# Altium project Pin radiation counter Main board.PrjPcb
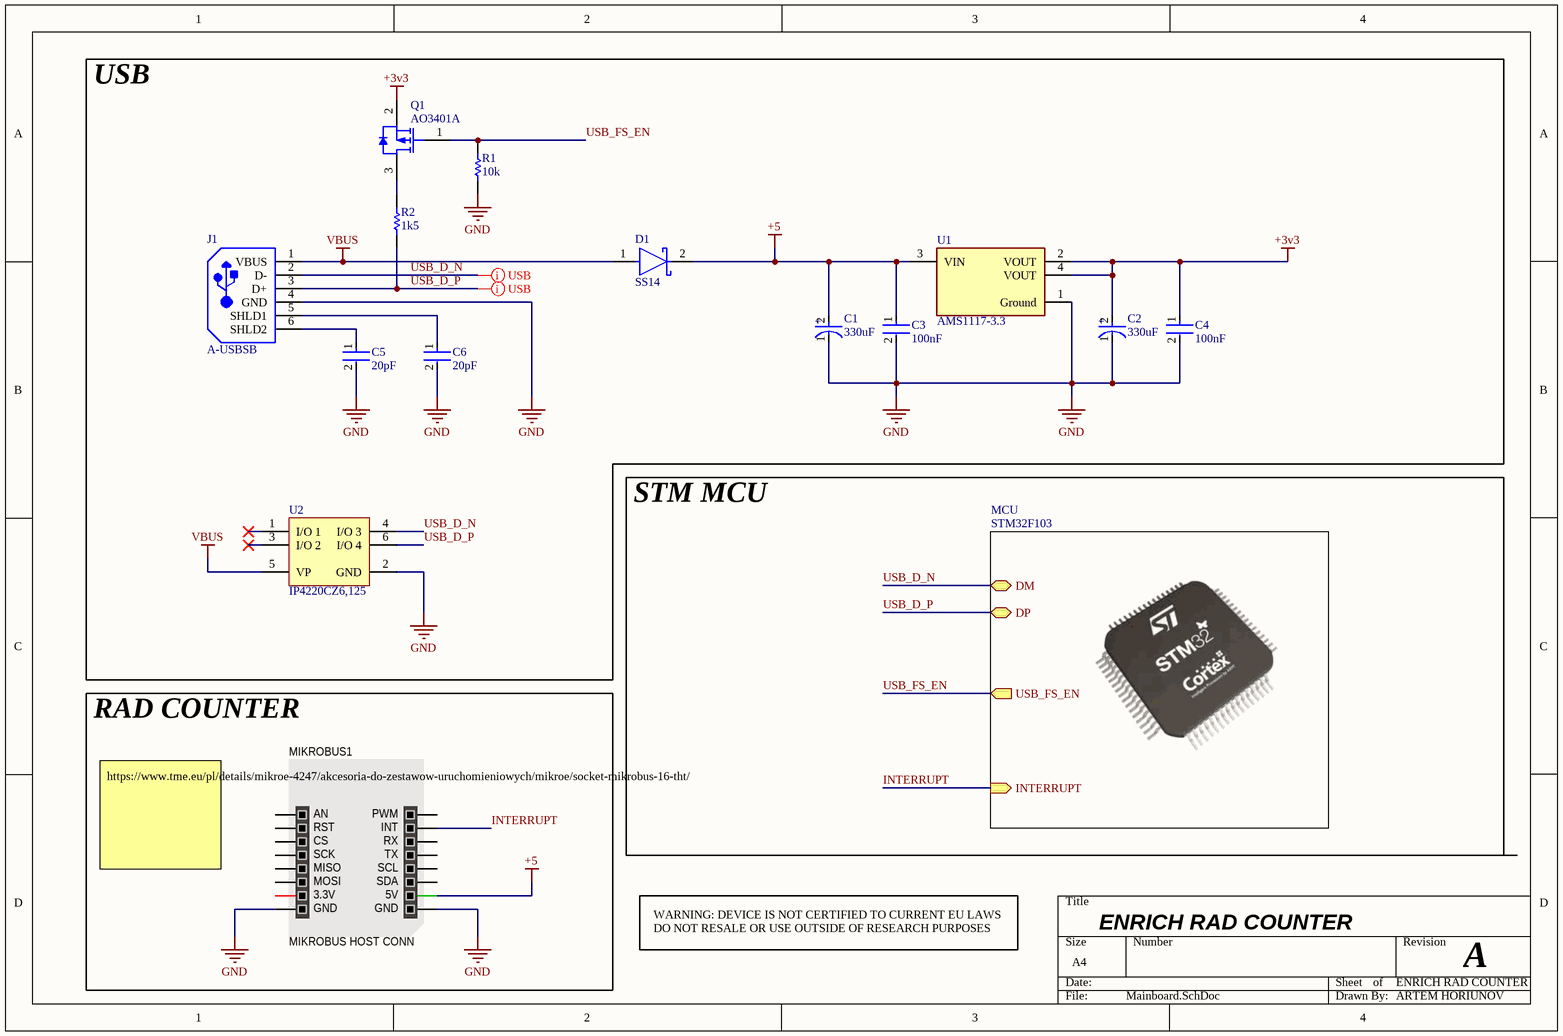
[diagram p0: Mainboard.SchDoc]
2 sheets, 51 parts. Net scope: hierarchical (ports join the sheet entries above them; power ports are global).
Board file: Mainboard.PcbDoc
Sheets:
  Mainboard.SchDoc
    MCU = STM32F103.SchDoc

## Sheet Mainboard.SchDoc
size A4; SheetNumber: 1; SheetTotal: 2

### Parts
C1  330uF  [FP-OS-CON-SMT-F12-MFG]
C2  330uF  [FP-OS-CON-SMT-F12-MFG]
C3  100nF  [FP-C0402-BB-MFG]
C4  100nF  [FP-C0402-BB-MFG]
C5  20pF  [FP-C0603C-CF-MFG]
C6  20pF  [FP-C0603C-CF-MFG]
D1  SS14  [FP-403AE-MFG]
J1  A-USBSB  [ASSM-A-USBSB-4_V]
MIKROBUS1  MIKROBUS HOST CONN  [MIKROBUS HOST CONN 8gen TH]
Q1  AO3401A  [AO-SOT-23-3L_V]
R1  10k  [RESC1609X50X30NL8T20]
R2  1k5  [RESC1608X55X30ML15T15]
U1  AMS1117-3.3  [FP-AMS1117-IPC_C]
U2  IP4220CZ6,125  [NXP-SOT457_L]

### Blocks framed on the sheet
USB: C1-C6 D1 J1 Q1 R1 R2 U1 U2
RAD COUNTER: MIKROBUS1

### Sub-sheets
MCU = STM32F103: DM (bidir), DP (bidir), INTERRUPT (in), USB_FS_EN (out)

### Nets
+3v3: C2.2(A) C4.1 Q1.2(SOURCE) U1.2(VOUT) U1.4(VOUT)
+5: C1.2(A) C3.1 D1.2(C) MIKROBUS1.10(5V) U1.3(VIN)
GND: C1.1(C) C2.1(C) C3.2 C4.2 C5.2 C6.2 J1.4(GND) MIKROBUS1.8(GND) MIKROBUS1.9(GND) R1.2 U1.1(Ground) U2.2(GND)
VBUS: D1.1(A) J1.1(VBUS) U2.5(VP)
INTERRUPT: MIKROBUS1.15(INT) ; sheet MCU/INTERRUPT
USB_D_N: J1.2(D-) U2.4(I/O_3) ; sheet MCU/DM
USB_D_P: J1.3(D+) R2.1 U2.6(I/O_4) ; sheet MCU/DP
USB_FS_EN: Q1.1(GATE) R1.1 ; sheet MCU/USB_FS_EN  [project net USB FS EN]
NetC5_1: C5.1 J1.6(SHLD2)
NetC6_1: C6.1 J1.5(SHLD1)
NetQ1_3: Q1.3(DRAIN) R2.2

Not connected (* = marked no-connect by the designer): MIKROBUS1 1(AN) 2(RST) 3(CS) 4(SCK) 5(MISO) 6(MOSI) 7(3.3V) 11(SDA) 12(SCL) 13(TX) 14(RX) 16(PWM); U2 1(I/O_1)* 3(I/O_2)*

### Layout directives
differential pair: USB_D_N, USB_D_P

### Notes on the sheet
- STM MCU
- https://www.tme.eu/pl/details/mikroe-4247/akcesoria-do-zestawow-uruchomieniowych/mikroe/socket-mikrobus-16-tht/
- WARNING: DEVICE IS NOT CERTIFIED TO CURRENT EU LAWS
- DO NOT RESALE OR USE OUTSIDE OF RESEARCH PURPOSES
- ENRICH RAD COUNTER
- A
- ARTEM HORIUNOV
- (in symbol CMP-2000-05494-3) +

### Library data of the parts
C1 C2 = CMP-2000-05494-3: Conductive Polymer Aluminum Solid Capacitors (OS-CON) 330uF ±20% 16V RADIAL SMT 10x12.6mm; Ripple Current: 4.72A; ESR (Equivalent Series Resistance): 16mR; Polarity: Polar; Dissipation Factor: 15%; Leakage Current: 792uA; Life (Hours): 2000Hour; REACH SVHC: No SVHC; Radiation Hardening: No; Termination: SMD/SMT; Height: 12.6mm; Package Quantity: 400; Capacitance: 330uF; Number of Pins: 12; Height - Seated (Max): 0.5inch; RoHS Compliant: Yes; Tolerance: 20%; Material: Polymer; Packaging: Tape and Reel; Mount: Surface Mount; Lead Free: Lead Free; Voltage Rating: 16V; Diameter: 10mm; Max Operating Temperature: 105°C; Voltage Rating (DC): 16V; Voltage: 16V; Ripple Current (AC): 4.72A; Construction: Cylindrical; Length: 12.6mm; Case/Package: Radial; Min Operating Temperature: -55°C; Series: OS-CON™, SVP
C3 C4 = CMP-2008-02046-2: CAP CER 0.1UF 10V X5R 0402; Manufacturer: Kemet; Manufacturer Part Number: C0402C104K8PACTU; Material: Ceramic; Capacitance: 0.10 μF; Temperature Coefficient: 15%; Tolerance: 0.1; Value: 0.10 μF; Package: C0402-BB; Temperature: -55°C to +125°C; ComponentLink2Description: Datasheet; Temperature Characteristic: X5R; Device Class L1: Passive Components; Height: 0.55mm; Lead Free: Yes; ComponentLink2URL: https://content.kemet.com/datasheets/KEM_C1002_X7R_SMD.pdf; Device Class L2: Capacitors; Temperature Range Low: -55°C; Temperature Range High: +125°C; RoHS: TRUE; Octopart: https://octopart.com/c0402c104k8pactu-kemet-140039; Automotive: No; Mouser Description: Capacitor 100 nF 10 VDC 0402; Category: Cap; Voltage Rating: 10 V; Digikey Description: CAP CER 0.1UF 10V X5R 0402; Ipc Land Pattern Name: CAPC10050X50; Device Class L3: Ceramic Capacitors
C5 C6 = CMP-1035-00783-3: CAP CER 20PF 50V 5% NP0 0603; Manufacturer Part Number: C0603C200J5GACTU; Manufacturer: KEMET; Temperature Coefficient: 30ppm/°C; Temperature Characteristic: C0G; Automotive Grade: Grade 1; Tolerance: 0.05; Material: Ceramic; Category: Cap; Temperature Range Low: -55°C; RoHS: TRUE; ComponentLink2URL: https://api.kemet.com/component-edge/download/datasheet/C0603C100J5GACAUTO.pdf; Package: C0603C-CF; Height: 0.87mm; Capacitance: 20 pF; Voltage Rating: 50 V; Octopart: https://octopart.com/c0603c200j5gactu-kemet-9138585; Device Class L1: Passive Components; Automotive: Yes; Digikey Description: CAP CER 20PF 50V 5% NP0 0603; Temperature Range High: +125°C; Device Class L3: Ceramic Capacitors; Mouser Description: Multilayer Ceramic Capacitors MLCC - SMD/SMT 50volts 20pF C0G 5%; ComponentLink2Description: Datasheet; Device Class L2: Capacitors; Lead Free: Yes; Temperature: -55°C to +125°C; Value: 20 pF
D1 = CMP-2000-04943-2: DIODE SCHOTTKY 40V 1A SMA; Manufacturer: ON Semiconductor; Peak Reverse Current: 0.2mA; Max Junction Temp: +125°C; Standoff Height: 0.05mm; Max Surge Forward Current: 40A; Mouser Description: Schottky Diodes & Rectifiers SMA 40V 1.0A; RoHS: TRUE; Lead Free: Yes; Manufacturer Part Number: SS14; Device Class L3: Schottky Diodes; Category: Diode; Automotive: No; Digikey Description: DIODE SCHOTTKY 40V 1A SMA; ComponentLink2Description: Datasheet; Device Class L2: Diodes; Height: 2.5mm; Temperature Range High: +125°C; ComponentLink2URL: https://www.onsemi.com/pub/Collateral/SS19-D.PDF; Device Class L1: Discrete Semiconductors; Package: 403AE; Octopart: https://octopart.com/ss14-on+semiconductor-29205033; Max Repetitive Reverse Voltage: 40V; Temperature Range Low: -65°C; Forward Current: 1A; Temperature: -65°C to +125°C
J1 = CMP-2000-05874-1: Connector Receptacle, USB Type B, Right Angle, -20 to 85 degC, 4-Pin THD, RoHS, Tray; Manufacturer: ASSMANN WSW; Gender: Female; CAD Drawing: 3DCADModel; Number of Ports: 1; Mounting Type: ThroughHole; Datasheet URL: https://datasheet.ciiva.com/11731/0900766b80da421f-11731321.pdf; Datasheet Version: 12/2009; Manufacturer URL: http://www.assmann.us/; Package Description: 4-Pin Through Hole Device, Body 16.5 x 12.04 mm; Body Orientation: RightAngle; Mounting Technology: ThroughHole; Package Reference: USBSB; Termination Method: Solder
Q1 = CMP-2000-05778-1: P-Channel MOSFET, 30 V, 4 A, -55 to 150 degC, 3-Pin SOT-23-3L, RoHS, Tape and Reel; Manufacturer: Alpha and Omega; Output Power (Max): NotRequiredW; Power Dissipation: 1.4W; Rad Hardened: No; Drain Efficiency: NotRequired%; Drain-Source On-Volt: 30V; Noise Figure: NotRequireddB; Frequency (Max): NotRequiredMHz; Number of  Elements: 1; Gate-Source Voltage (Max): ?12V; Drain Current (Max): 4A; Channel Mode: Enhancement; Drain-Source On-Res: 0.044ohm; Type: PowerMOSFET; Polarity: P; Package URL: http://www.aosmd.com/res/packaging_information/SOT-23-3L.pdf; Datasheet URL: http://www.aosmd.com/res/data_sheets/AO3401A.pdf; Package Type: SOT-23; Package Description: 3-Pin Small Outline Transistor, Body 2.95 x 1.6 mm, Pitch 0.95 mm; Mounting: SurfaceMount; Manufacturer URL: http://www.aosmd.com/; Continuous Drain Current: 4A; Package Reference: SOT-23-3L; Mounting Technology: SurfaceMount; Operating Temperature Classification: Military; Power Gain: NotRequireddB; Datasheet Version: Rev. 3, 03/2011; Operating Temp Range: -55Cto150C; Pin Count: 3
R1 = CMP-1666-00005-4: Chip Resistor, 10 KOhm, +/- 1%, 100 mW, -55 to 155 degC, 0603 (1608 Metric), RoHS, Tape and Reel; Manufacturer: Vishay Semiconductor; Voltage Rating: 75 V; Max Operating Temperature: 155 degC; PackageDescription: 2-Pin Surface Mount Device, Body 1.575 x 0.85 mm; ComponentLink1Description: Manufacturer URL; RoHSCompliant: true; PackageReference: 0603; REACH SVHC: Unknown; Length: 1.55 mm; DatasheetVersion: 06/2012; Packaging: Tape and Reel; Min Operating Temperature: -55 degC; Mounting Technology: Surface Mount; ComponentLink2URL: https://datasheet.ciiva.com/11809/0900766b80d98afc-11809037.pdf; Height: 0.45 mm; ComponentLink2Description: Datasheet; Package Quantity: 5000; ComponentLink1URL: http://www.vishay.com/
R2 = CMP-1012-00528-2: Part Number: ERJ-3EKF1501V; Manufacturer: Panasonic
U1 = CMP-209535-000001-1: LDO Voltage Regulators 1A, 3.3V; Manufacturer: Advanced Monolithic Systems; Dropout Voltage: 1.1V; Output Type: Fixed; Nominal Supply Current: 5mA; Max Power Dissipation: 1.2W; Max Supply Voltage: 15V; Number Of Outputs: 1; Standoff Height: 0.64mm; Max Junction Temp: +125°C; Height: 1.8mm; Package: AMS1117; Device Class L2: Power Management ICs; ComponentLink2Description: Datasheet; ComponentLink2URL: http://www.advanced-monolithic.com/pdf/ds1117.pdf; Category: IC; RoHS: TRUE; Automotive: No; Device Class L1: Integrated Circuits (ICs); Output Current: 1A; Device Class L3: Voltage Regulators - Linear; Temperature: -40°C to +125°C; Output Voltage: 3.3V; Manufacturer Part Number: AMS1117-3.3; Temperature Range Low: -40°C; Octopart: https://octopart.com/ams1117-3.3-advanced+monolithic+systems-25899300; Lead Free: Yes; Ipc Land Pattern Name: SOT229P700X180-4; Temperature Range High: +125°C
U2 = CMP-2000-06457-1: Dual USB 2.0 integrated ESD protection, 0 to 5.5 V, -40 to 85 degC, 6-Pin TSOP (SOT457), RoHS, Tape and Reel; Manufacturer: NXP Semiconductors; Product Height (mm): 1mm; Rad Hardened: No; Package Version: 06-03-16, 03/2006; Product Length (mm): 3.1mm; VIN Max: 5.5V; Configuration: Quad; Suppressor Type: DiodeArrays; Number of Channels: 4; VF: 0.7V; Capacitance Value: 1.2pF; Product Depth (mm): 1.7mm; VIN Min: 0V; Leakage Current (Max): 0.1uA; ESD Protection Voltage: 8KV@ContactDisc; Direction Type: Uni-Directional; Manufacturer URL: http://www.nxp.com/; Package Reference: SOT457; Datasheet URL: http://cache.nxp.com/documents/data_sheet/IP4220CZ6.pdf; Operating Temperature Max Deg. C: 85C; Packaging: TapeandReel; Package Description: 6-Pin Thin Small Outline Package, Body 2.9 x 1.5 mm, Pitch 0.95 mm; PartNumber: IP4220CZ6; Mounting Technology: SurfaceMount; Working Voltage (Max): 5.5V; Operating Temperature Min Deg. C: -40C; Working Voltage: 5.5V; Package / Case: TSOP; Package URL: http://www.nxp.com/documents/outline_drawing/sot457_po.pdf; Leakage Current: 0.1uA; Pin Count: 6; Mounting Style: SurfaceMount; Datasheet Version: Rev. 5, 07/2011

## Sheet STM32F103.SchDoc
size A4; SheetNumber: 2; SheetTotal: 2
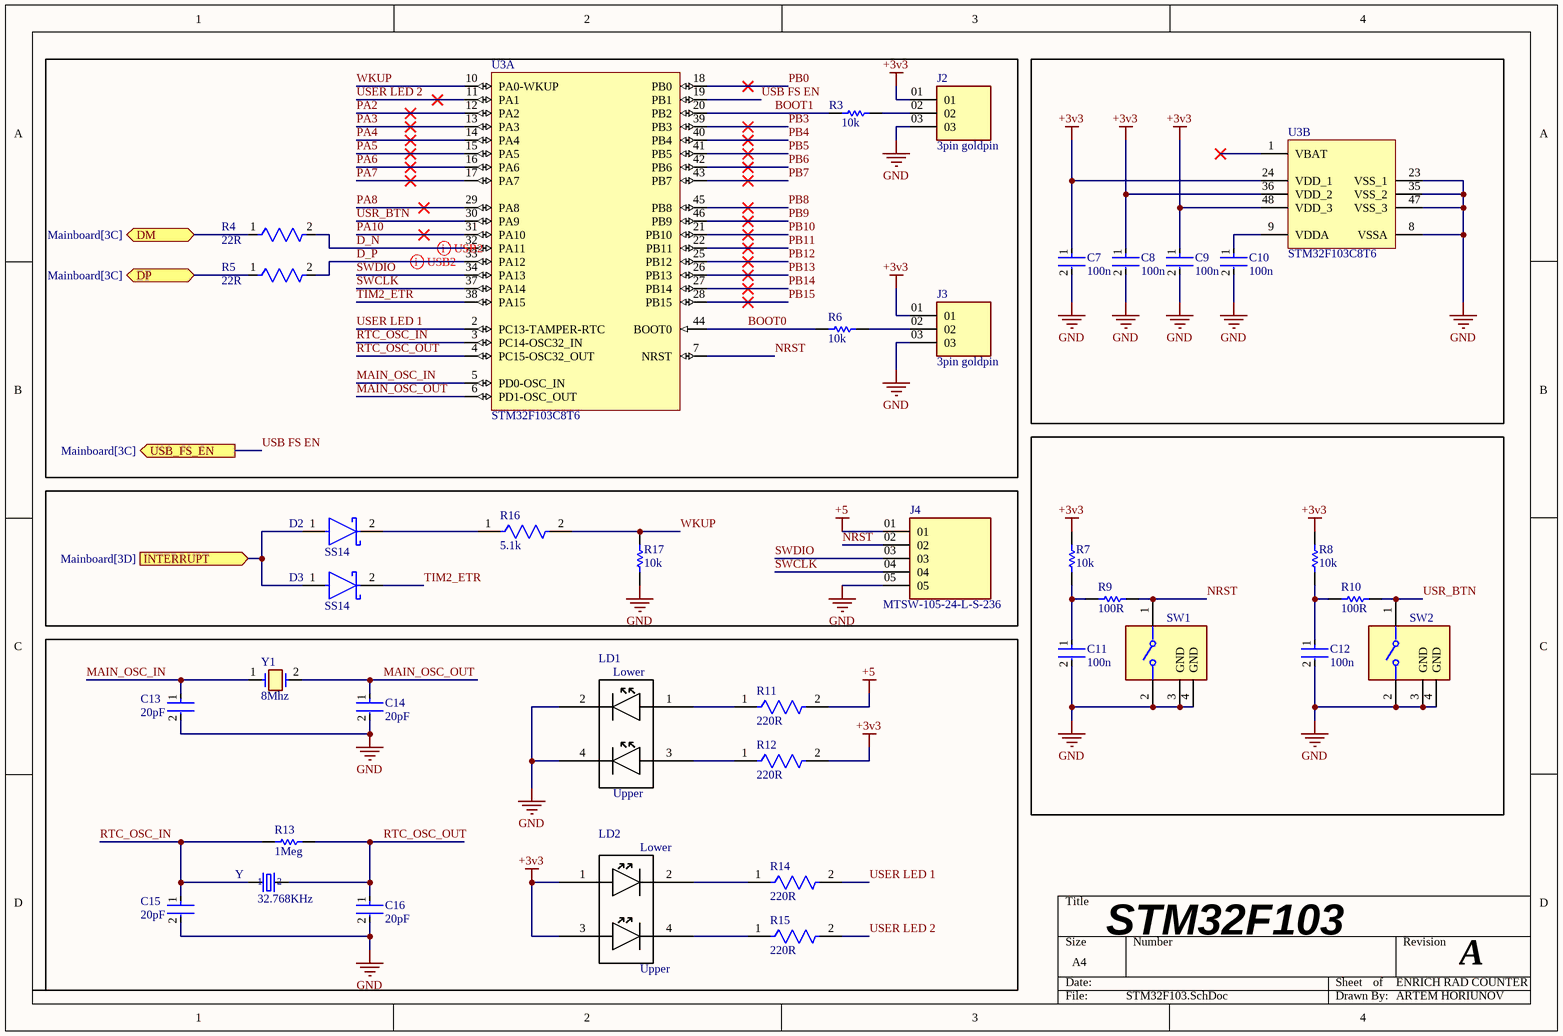
[diagram p1: STM32F103.SchDoc]

### Parts
C7  100n  [FP-CGA3E-0_3-0_1-IPC_A]
C8  100n  [FP-CGA3E-0_3-0_1-IPC_A]
C9  100n  [FP-CGA3E-0_3-0_1-IPC_A]
C10  100n  [FP-CGA3E-0_3-0_1-IPC_A]
C11  100n  [FP-C0603C-CF-MFG]
C12  100n  [FP-C0603C-CF-MFG]
C13  20pF  [FP-C0603C-CF-MFG]
C14  20pF  [FP-C0603C-CF-MFG]
C15  20pF  [FP-C0603C-CF-MFG]
C16  20pF  [FP-C0603C-CF-MFG]
D2  SS14  [FP-403AE-MFG]
D3  SS14  [FP-403AE-MFG]
J2  3pin goldpin  [SAMTEC_HMTSW-103-XX-X-S-XXX]
J3  3pin goldpin  [SAMTEC_HMTSW-103-XX-X-S-XXX]
J4  MTSW-105-24-L-S-236  [SAMTEC_MTSW-105-24-L-S-236]
LD1  (no value)  [LED_HOLDER]
LD2  (no value)  [LED_HOLDER]
R3  10k  [RESC1609X50X30NL8T20]
R4  22R  [FP-RC0402-0_4-MFG]
R5  22R  [FP-RC0402-0_4-MFG]
R6  10k  [RESC1609X50X30NL8T20]
R7  10k  [RESC0603(1608)_N]
R8  10k  [RESC0603(1608)_N]
R9  100R  [RESC0603(1608)_N]
R10  100R  [RESC0603(1608)_N]
R11  220R  [FP-CRCW0603-HPe3-IPC_A]
R12  220R  [FP-CRCW0603-HPe3-IPC_A]
R13  1Meg  [RESC1608X55X25LL10T15]
R14  220R  [FP-CRCW0603-HPe3-IPC_A]
R15  220R  [FP-CRCW0603-HPe3-IPC_A]
R16  5.1k  [FP-CRCW0603-e3-IPC_C]
R17  10k  [RESC0603(1608)_N]
SW1  B3F-3122  [FP-B3F-3122-MFG]  (value not drawn)
SW2  B3F-3122  [FP-B3F-3122-MFG]  (value not drawn)
U3  STM32F103C8T6  [STM-LQFP48_L]  (parts A,B of 2)
Y  32.768KHz  [X2-SMD-5.0X3.2X1.3MM]
Y1  8Mhz  [XTAL_NX3215SA-32.768K-STD-MUA-14]

### Ports
DM (bidir, see Mainboard[3C]), DP (bidir, see Mainboard[3C]), INTERRUPT (in, see Mainboard[3D]), USB_FS_EN (out, see Mainboard[3C])

### Nets
+3v3: C7.1 C8.1 C9.1 J2.01 J3.01 LD2.1 LD2.3 R7.2 R8.2 R12.2 U3.24(VDD_1) U3.36(VDD_2) U3.48(VDD_3)
+5: J4.01 R11.2
GND: C7.2 C8.2 C9.2 C10.2 C11.2 C12.2 C13.2 C14.2 C15.2 C16.2 J2.03 J3.03 J4.05 LD1.2 LD1.4 R17.1 SW1.2 SW1.3(GND) SW1.4(GND) SW2.2 SW2.3(GND) SW2.4(GND) U3.8(VSSA) U3.23(VSS_1) U3.35(VSS_2) U3.47(VSS_3)
BOOT0: R6.1 U3.44(BOOT0)
BOOT1: R3.1 U3.20(PB2)
D_N: R4.2 U3.32(PA11)
D_P: R5.2 U3.33(PA12)
INTERRUPT: D2.1(A) D3.1(A) ; port INTERRUPT
MAIN_OSC_IN: C13.1 U3.5(PD0-OSC_IN) Y1.1
MAIN_OSC_OUT: C14.1 U3.6(PD1-OSC_OUT) Y1.2
NRST: J4.02 R9.1 SW1.1 U3.7(NRST)
PA2: U3.12(PA2)
PA3: U3.13(PA3)
PA4: U3.14(PA4)
PA5: U3.15(PA5)
PA6: U3.16(PA6)
PA7: U3.17(PA7)
PA8: U3.29(PA8)
PA10: U3.31(PA10)
PB0: U3.18(PB0)
PB3: U3.39(PB3)
PB4: U3.40(PB4)
PB5: U3.41(PB5)
PB6: U3.42(PB6)
PB7: U3.43(PB7)
PB8: U3.45(PB8)
PB9: U3.46(PB9)
PB10: U3.21(PB10)
PB11: U3.22(PB11)
PB12: U3.25(PB12)
PB13: U3.26(PB13)
PB14: U3.27(PB14)
PB15: U3.28(PB15)
RTC_OSC_IN: C15.1 R13.1 U3.3(PC14-OSC32_IN) Y.1
RTC_OSC_OUT: C16.1 R13.2 U3.4(PC15-OSC32_OUT) Y.2
SWCLK: J4.04 U3.37(PA14)
SWDIO: J4.03 U3.34(PA13)
TIM2_ETR: D3.2(C) U3.38(PA15)
USB FS EN: U3.19(PB1) ; port USB_FS_EN
USB_D_N: R4.1 ; port DM
USB_D_P: R5.1 ; port DP
USER LED 1: R14.2 U3.2(PC13-TAMPER-RTC)
USER LED 2: R15.2 U3.11(PA1)
USR_BTN: R10.1 SW2.1 U3.30(PA9)
WKUP: R16.2 R17.2 U3.10(PA0-WKUP)
NetC10_1: C10.1 U3.9(VDDA)
NetC11_1: C11.1 R7.1 R9.2
NetC12_1: C12.1 R8.1 R10.2
NetD2_2: D2.2(C) R16.1
NetJ2_02: J2.02 R3.2
NetJ3_02: J3.02 R6.2
NetLD1_1: LD1.1 R11.1
NetLD1_3: LD1.3 R12.1
NetLD2_2: LD2.2 R14.1
NetLD2_4: LD2.4 R15.1

Not connected (* = marked no-connect by the designer): U3 1(VBAT)*

### Layout directives
differential pair; net class USB: D_N, D_P

### Notes on the sheet
- STM32F103
- ENRICH RAD COUNTER
- A
- ARTEM HORIUNOV
- (in symbol DoubleStack_Side_Led_3mm) Lower; Upper

### Library data of the parts
C7-C10 = CMP-2000-07546-2: Cap Ceramic 100nF 50V X7R 10% Pad SMD 0603 +125°C Automotive T/R; Weight: 7.1E-05oz; Composition: Ceramic; Max Operating Temperature: 125°C; Termination: SMD/SMT; Dielectric: X7R; Length: 1.6mm; Package Quantity: 1; REACH SVHC: No SVHC; Lead Free: Lead Free; Case Code (Metric): 1608; Min Operating Temperature: -55°C; Packaging: Tape and Reel; Tolerance: 10%; Voltage Rating: 50V; Case Code (Imperial): 0603; Capacitance: 100nF; Case/Package: 0603; Voltage Rating (DC): 50V; Depth: 0.8mm; Radiation Hardening: No; Ratings: AEC-Q200; Mount: Surface Mount; Voltage: 50V; Thickness: 0.035inch; Width: 0.8mm; Height: 0.8mm
C11 C12 = CMP-2006-03061-2: CAP CER 0.1UF 50V X7R 0603; Manufacturer: KEMET; Manufacturer Part Number: C0603C104K5RACTU; Tolerance: 0.1; Temperature Coefficient: 30ppm/°C; Material: Ceramic; Automotive Grade: Grade 1; Value: 0.10 μF; Temperature: -55°C to +125°C; RoHS: TRUE; Temperature Range High: +125°C; Lead Free: Yes; Octopart: https://octopart.com/c0603c104k5ractu-kemet-139244; Digikey Description: CAP CER 0.1UF 50V X7R 0603; Category: Cap; Package: C0603C-CF; ComponentLink2Description: Datasheet; Temperature Range Low: -55°C; Device Class L1: Passive Components; Voltage Rating: 50 V; Automotive: Yes; Device Class L3: Ceramic Capacitors; ComponentLink2URL: https://api.kemet.com/component-edge/download/datasheet/C0603C100J5GACAUTO.pdf; Capacitance: 0.10 μF; Device Class L2: Capacitors; Temperature Characteristic: X7R; Height: 0.87mm
C13-C16 = CMP-1035-00783-3: as C5 on sheet Mainboard; Category: Cap; Temperature Range Low: -55°C; RoHS: TRUE; ComponentLink2URL: https://api.kemet.com/component-edge/download/datasheet/C0603C100J5GACAUTO.pdf; Package: C0603C-CF; Height: 0.87mm; Capacitance: 20 pF; Voltage Rating: 50 V; Octopart: https://octopart.com/c0603c200j5gactu-kemet-9138585; Device Class L1: Passive Components; Automotive: Yes; Digikey Description: CAP CER 20PF 50V 5% NP0 0603; Temperature Range High: +125°C; Device Class L3: Ceramic Capacitors; Mouser Description: Multilayer Ceramic Capacitors MLCC - SMD/SMT 50volts 20pF C0G 5%; ComponentLink2Description: Datasheet; Device Class L2: Capacitors; Lead Free: Yes; Temperature: -55°C to +125°C; Value: 20 pF
D2 D3 = CMP-2000-04943-2: as D1 on sheet Mainboard; Mouser Description: Schottky Diodes & Rectifiers SMA 40V 1.0A; RoHS: TRUE; Lead Free: Yes; Manufacturer Part Number: SS14; Device Class L3: Schottky Diodes; Category: Diode; Automotive: No; Digikey Description: DIODE SCHOTTKY 40V 1A SMA; ComponentLink2Description: Datasheet; Device Class L2: Diodes; Height: 2.5mm; Temperature Range High: +125°C; ComponentLink2URL: https://www.onsemi.com/pub/Collateral/SS19-D.PDF; Device Class L1: Discrete Semiconductors; Package: 403AE; Octopart: https://octopart.com/ss14-on+semiconductor-29205033; Max Repetitive Reverse Voltage: 40V; Temperature Range Low: -65°C; Forward Current: 1A; Temperature: -65°C to +125°C
J2 J3 = HMTSW-103-XX-X-S-XXX: Headers & Wire Housings; MP: HMTSW-103-13-L-S-100; MF: Samtec; Package: None; SnapEDA_Link: https://www.snapeda.com/parts/HMTSW-103-13-L-S-100/Samtec/view-part/?ref=snap; Value: *; Availability: In Stock; Price: None; Check_prices: https://www.snapeda.com/parts/HMTSW-103-13-L-S-100/Samtec/view-part/?ref=eda
LD1 LD2 = DoubleStack_Side_Led_3mm
R3 R6 = CMP-1666-00005-4: as R1 on sheet Mainboard; Max Operating Temperature: 155 degC; PackageDescription: 2-Pin Surface Mount Device, Body 1.575 x 0.85 mm; ComponentLink1Description: Manufacturer URL; RoHSCompliant: true; PackageReference: 0603; REACH SVHC: Unknown; Length: 1.55 mm; DatasheetVersion: 06/2012; Packaging: Tape and Reel; Min Operating Temperature: -55 degC; Mounting Technology: Surface Mount; ComponentLink2URL: https://datasheet.ciiva.com/11809/0900766b80d98afc-11809037.pdf; Height: 0.45 mm; ComponentLink2Description: Datasheet; Package Quantity: 5000; ComponentLink1URL: http://www.vishay.com/
R4 R5 = CMP-2002-07520-2: Tolerance: 1%; Power Rating: 63mW; Voltage Rating: 50V; Temperature Coefficient: 100ppm/°C; Resistance: 22Ω; Termination: SMD/SMT; Depth: 500µm; Packaging: Tape & Reel; Height: 400µm; Width: 500µm; Case Code (Imperial): 0402; Length: 1mm; Schedule B: 8533210045, 8533210045; Case/Package: 0402; Max Operating Temperature: 155°C; Min Operating Temperature: -55°C; REACH SVHC: Unknown; RoHS: Compliant; Military Standard: Not; Voltage Rating (DC): 50V; Lead Free: Lead Free; Voltage Rating (AC): 50V; Number of Pins: 2; Composition: Thick Film
R7-R10 R17 = CMP-1012-00081-1: 0.1W 5% 0603 (1608 Metric)  SMD; Case-Metric: 1608; Value: 2000.00 Ohm; Case-EIA: 0603; Tolerance: 5 %; Technology: SMT; Power: 0.1 W
R11 R12 R14 R15 = CMP-02407-003593-1: RES Thick Film, 220Ω, 1%, 0.33W, 100ppm/°C, 0603; Max Power Dissipation: 250mW; Voltage Rating (DC): 75V; Radiation Hardening: No; Contact Plating: Tin; Length: 1.6mm; Depth: 0.85mm; Composition: Thick Film; Lead Free: Lead Free; Mount: Surface Mount; Package Quantity: 5000; Height: 0.45mm; Termination: SMD/SMT; Weight: 7.1E-05oz; Military Standard: Not; Number of Terminations: 2; Case Code (Metric): 1608; Max Operating Temperature: 155°C; Power Rating: 250mW; Tolerance: 1%; Temperature Coefficient: 100ppm/°C; Features: Automotive AEC-Q200; Case Code (Imperial): 0603; Width: 0.033inch; Min Operating Temperature: -55°C; Case/Package: 0603; Resistance: 220R; Voltage Rating: 75V; Packaging: Tape and Reel
R13 = CMP-1659-00056-1: Chip Resistor, 1 MOhm, +/- 1%, 100 mW, -55 to 155 degC, 0603 (1608 Metric), RoHS, Tape and Reel; Voltage Rating (DC): 25 V; Tolerance: 20%; Case\Package: Radial; Capacitance: 1 mF; Min Operating Temperature: -40 degC; PackageDescription: 2-Pin Surface Mount Device, Body 1.6 x 0.8 mm; ComponentLink1Description: Manufacturer URL; Radiation Hardening: No; DatasheetVersion: Rev. 4, 02/2016; REACH SVHC: No SVHC; Length: 20 mm; Max Operating Temperature: 85 degC; Diameter: 10 mm; Packaging: Bulk; Package Quantity: 200; PackageReference: 0603; Mount: Through Hole; ComponentLink1URL: http://www.yageo.com/; ComponentLink2URL: http://www.yageo.com/documents/recent/PYu-RC_Group_51_RoHS_L_04.pdf; ComponentLink2Description: Datasheet; Width: 0 inch; Lead Pitch: 5 mm; RoHSCompliant: true; Voltage Rating: 25 V; Height: 20 mm
R16 = CMP-1012-00590-3: RES Thick Film, 5.1kΩ, 1%, 0.1W, 100ppm/°C, 0603; Power Rating: 100mW; Voltage Rating (DC): 75V; Resistance: 5.1kR; Width: 0.85mm; Depth: 0.85mm; Military Standard: Not; Package Quantity: 5000; Case Code (Metric): 1608; Length: 1.55mm; Weight: 7.1E-05oz; Packaging: Tape and Reel; Temperature Coefficient: 100ppm/°C; Case Code (Imperial): 0603; Lead Free: Lead Free; Radiation Hardening: No; Contact Plating: Tin; Composition: Thick Film; Max Operating Temperature: 155°C; Termination: SMD/SMT; Case/Package: 0603; Min Operating Temperature: -55°C; Tolerance: 1%; Voltage Rating: 75V; Mount: Surface Mount; Height: 0.45mm
SW1 SW2 = CMP-08834-000053-1: SWITCH TACTILE SPST-NO 0.05A 24V; Max Current Rating: 50mA; Actuator Type: Standard; Ratings: IP00; Number of Poles: 1; Mechanical Life: 300000Cycles; Illumination Type: Non-Illuminated; Switch Function: Off-Mom; Actuator Color: Grey; Contact Resistance: 100mR; Throw Configuration: SPST; Actuator Length: 1.6mm; Switch Travel: 0.25mm; Operating Force: 1.47N; Weight: 0.25g; Voltage Rating (DC): 24V; Contact Plating: Gold; RoHS Compliant: Yes; Contact Material: Gold; Radiation Hardening: No; Packaging: Bulk; Height: 7.4mm; Min Operating Temperature: -25°C; Electrical Life: 300000Cycles; Depth: 7.85mm; Max Voltage Rating (DC): 24V; Mount: Through Hole; Width: 6.25mm; Current Rating: 50mA; Lead Free: Lead Free; Max Operating Temperature: 70°C; Series: B3F; Contact Current Rating: 50mA; Package Quantity: 1000; Termination: PC Pins; Orientation: Right Angle; Length: 7.3mm
U3 = CMP-0237-00215-3: ARM Cortex-M3 32-bit MCU, 64 KB Flash, 20 KB Internal RAM, 37 I/Os, 48-pin LQFP, -40 to 85 degC, Tray; Supply Voltage(Vcc) min (V): 2; Internal RAM Size (kB): 20; FLASH Size (Prog) (kB): 64; A/D Converter: 2x12-bit (10 Channel); I/Os (High Current): 37; Operating Frequency(F) (Processor speed) (MHz): 72; Core: ARM Cortex-M3; ComponentLink3Description: Package Specification; Mounting Technology: Surface Mount; PartNumber: STM32F103C8T6; PackageReference: LQFP48; Packing: Tray; ComponentLink3URL: http://www.st.com/st-web-ui/static/active/en/resource/technical/document/datasheet/DM00058181.pdf; DatasheetVersion: Rev. 16; ComponentLink1URL: http://www.st.com/web/en/home.html; PackageVersion: Rev. 6, 06/2013; ComponentLink2URL: http://www.st.com/st-web-ui/static/active/en/resource/technical/document/datasheet/CD00161566.pdf; ComponentLink1Description: Manufacturer URL; ComponentLink2Description: Datasheet; PackageDescription: 48-Pin Low Profile Quad Flat Package, 7 x 7 mm Body, 0.5 mm Pitch
Y = SMD-CRYSTAL-8MHZ-20PF-20PPM(2P-5.0X3.2MM): 32.768KHz quartz; MF: Xinhunjing; MP: 5032/4P; Price: None; Availability: Unavailable; Package: None; SnapEDA_Link: https://www.snapeda.com/parts/5032/4P/Xinhunjing/view-part/105660/?ref=snap; Value: *
Y1 = NX3215SA-32.768K-STD-MUA-14: 8MHz quartz; Availability: Unavailable; Package: None; MP: NX3215SA-32.768K-STD-MUA-14; Value: *; Price: None
J4 = MTSW-105-24-L-S-236: Value: *; Package: None; Price: None; Availability: Unavailable; MP: MTSW-105-24-L-S-236

## Nets that join several sheets
+3v3: Mainboard (5 pins), STM32F103 (13 pins)
+5: Mainboard (5 pins), STM32F103 (J4.01 R11.2)
GND: Mainboard (12 pins), STM32F103 (26 pins)
INTERRUPT: Mainboard (MIKROBUS1.15), STM32F103 (D2.1 D3.1)
USB FS EN: Mainboard (Q1.1 R1.1), STM32F103 (U3.19)
USB_D_N: Mainboard (J1.2 U2.4), STM32F103 (R4.1)
USB_D_P: Mainboard (J1.3 R2.1 U2.6), STM32F103 (R5.1)